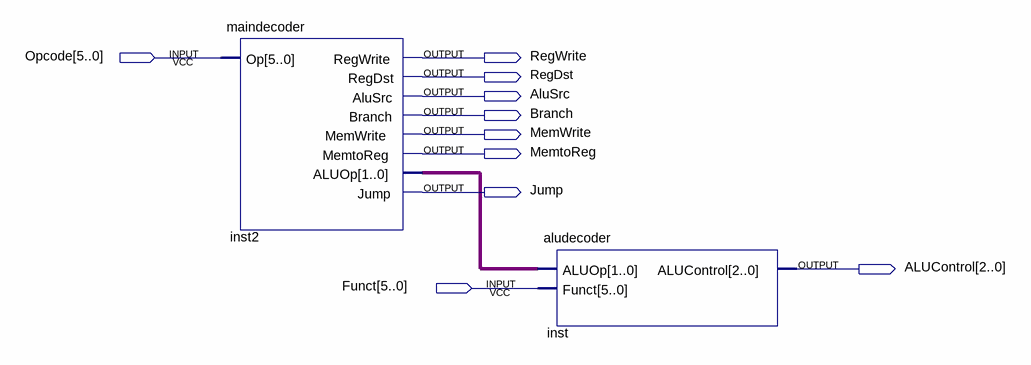
[diagram p0: schematic sheet]
// Quartus schematic controlunit.bdf as structural Verilog: 2 symbols, 10 pins
module controlunit (
  input  [5:0] Opcode,
  input  [5:0] Funct,
  output RegWrite,
  output RegDst,
  output AluSrc,
  output Branch,
  output MemWrite,
  output MemtoReg,
  output Jump,
  output [2:0] ALUControl
);

  wire [1:0] inst2_aluop;

  maindecoder inst2 (
    .Op(Opcode), .RegWrite(RegWrite), .RegDst(RegDst), .AluSrc(AluSrc), .Branch(Branch), .MemWrite(MemWrite),
    .MemtoReg(MemtoReg), .ALUOp(inst2_aluop), .Jump(Jump));
  aludecoder inst (.ALUOp(inst2_aluop), .Funct(Funct), .ALUControl(ALUControl));
endmodule
